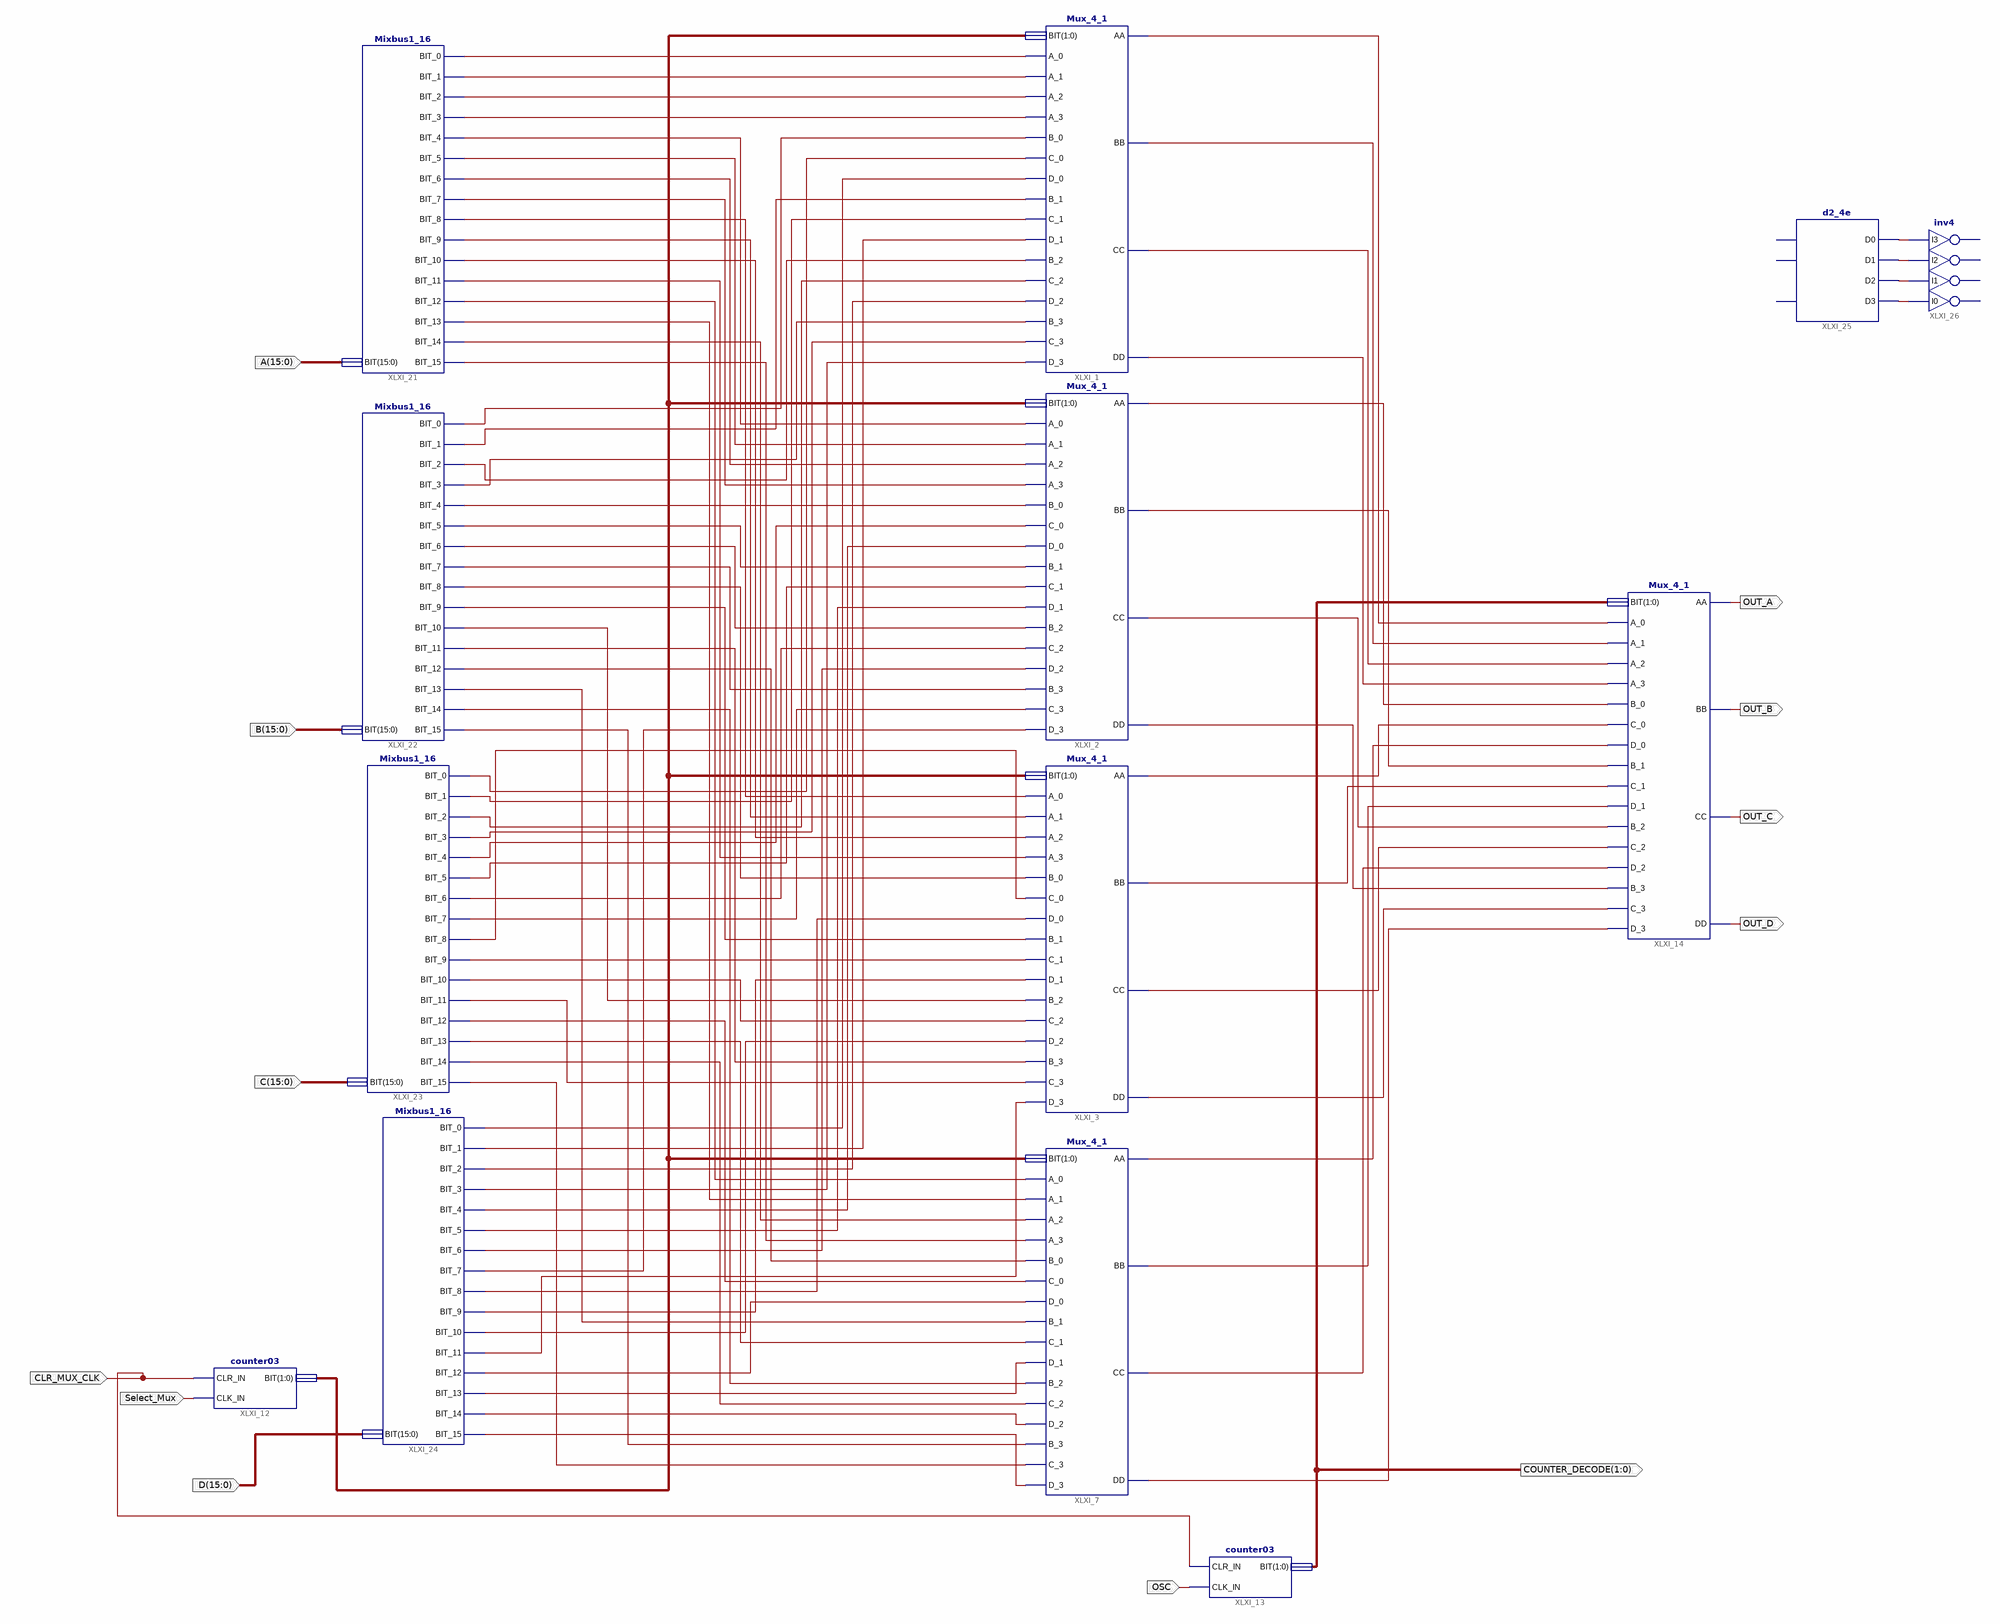
[diagram p0: schematic sheet 1]
// Xilinx ISE schematic Mux_Swap_LED_4.sch (spartan6) as structural Verilog: 13 symbols, 12 ports
module Mux_Swap_LED_4 (
  input  Select_Mux,
  input  CLR_MUX_CLK,
  input  OSC,
  input  [15:0] A,
  input  [15:0] D,
  input  [15:0] B,
  input  [15:0] C,
  output [1:0] COUNTER_DECODE,
  output OUT_A,
  output OUT_B,
  output OUT_C,
  output OUT_D
);

  wire XLXN_11, XLXN_12, XLXN_13, XLXN_14, XLXN_36, XLXN_38, XLXN_39, XLXN_63, XLXN_75, XLXN_84, XLXN_87,
       XLXN_90, XLXN_109, XLXN_110, XLXN_111, XLXN_113, XLXN_114, XLXN_115, XLXN_116, XLXN_117, XLXN_118,
       XLXN_119, XLXN_120, XLXN_121, XLXN_122, XLXN_126, XLXN_127, XLXN_128, XLXN_129, XLXN_130, XLXN_131,
       XLXN_132, XLXN_133, XLXN_134, XLXN_135, XLXN_136, XLXN_137, XLXN_138, XLXN_139, XLXN_140, XLXN_141,
       XLXN_142, XLXN_143, XLXN_144, XLXN_145, XLXN_146, XLXN_147, XLXN_148, XLXN_149, XLXN_150, XLXN_151,
       XLXN_152, XLXN_153, XLXN_154, XLXN_155, XLXN_157, XLXN_158, XLXN_159, XLXN_160, XLXN_161, XLXN_162,
       XLXN_163, XLXN_164, XLXN_165, XLXN_166, XLXN_167, XLXN_168, XLXN_169, XLXN_170, XLXN_171, XLXN_172,
       XLXN_173, XLXN_174, XLXN_175, XLXN_176, XLXN_177, XLXN_178, XLXN_179, XLXN_180, XLXN_181, XLXN_182,
       XLXN_183, XLXN_184, XLXN_185;
  wire [1:0] XLXN_1;

  Mux_4_1 XLXI_1 (
    .BIT(XLXN_1), .A_0(XLXN_36), .A_1(XLXN_109), .A_2(XLXN_38), .A_3(XLXN_39), .B_0(XLXN_126),
    .C_0(XLXN_141), .D_0(XLXN_169), .B_1(XLXN_127), .C_1(XLXN_142), .D_1(XLXN_168), .B_2(XLXN_128),
    .C_2(XLXN_143), .D_2(XLXN_167), .B_3(XLXN_129), .C_3(XLXN_144), .D_3(XLXN_166), .AA(XLXN_11),
    .BB(XLXN_12), .CC(XLXN_13), .DD(XLXN_14));
  Mux_4_1 XLXI_2 (
    .BIT(XLXN_1), .A_0(XLXN_110), .A_1(XLXN_111), .A_2(XLXN_113), .A_3(XLXN_114), .B_0(XLXN_63),
    .C_0(XLXN_145), .D_0(XLXN_165), .B_1(XLXN_130), .C_1(XLXN_146), .D_1(XLXN_164), .B_2(XLXN_131),
    .C_2(XLXN_147), .D_2(XLXN_163), .B_3(XLXN_132), .C_3(XLXN_148), .D_3(XLXN_162), .AA(XLXN_170),
    .BB(XLXN_171), .CC(XLXN_172), .DD(XLXN_173));
  Mux_4_1 XLXI_3 (
    .BIT(XLXN_1), .A_0(XLXN_115), .A_1(XLXN_116), .A_2(XLXN_117), .A_3(XLXN_118), .B_0(XLXN_133),
    .C_0(XLXN_149), .D_0(XLXN_161), .B_1(XLXN_134), .C_1(XLXN_75), .D_1(XLXN_160), .B_2(XLXN_135),
    .C_2(XLXN_150), .D_2(XLXN_159), .B_3(XLXN_136), .C_3(XLXN_151), .D_3(XLXN_158), .AA(XLXN_174),
    .BB(XLXN_175), .CC(XLXN_176), .DD(XLXN_177));
  Mux_4_1 XLXI_7 (
    .BIT(XLXN_1), .A_0(XLXN_119), .A_1(XLXN_120), .A_2(XLXN_121), .A_3(XLXN_122), .B_0(XLXN_137),
    .C_0(XLXN_152), .D_0(XLXN_157), .B_1(XLXN_138), .C_1(XLXN_153), .D_1(XLXN_90), .B_2(XLXN_139),
    .C_2(XLXN_154), .D_2(XLXN_87), .B_3(XLXN_140), .C_3(XLXN_155), .D_3(XLXN_84), .AA(XLXN_178),
    .BB(XLXN_179), .CC(XLXN_180), .DD(XLXN_181));
  counter03 XLXI_12 (.CLR_IN(CLR_MUX_CLK), .CLK_IN(Select_Mux), .BIT(XLXN_1));
  counter03 XLXI_13 (.CLR_IN(CLR_MUX_CLK), .CLK_IN(OSC), .BIT(COUNTER_DECODE));
  Mux_4_1 XLXI_14 (
    .BIT(COUNTER_DECODE), .A_0(XLXN_11), .A_1(XLXN_12), .A_2(XLXN_13), .A_3(XLXN_14), .B_0(XLXN_170),
    .C_0(XLXN_174), .D_0(XLXN_178), .B_1(XLXN_171), .C_1(XLXN_175), .D_1(XLXN_179), .B_2(XLXN_172),
    .C_2(XLXN_176), .D_2(XLXN_180), .B_3(XLXN_173), .C_3(XLXN_177), .D_3(XLXN_181), .AA(OUT_A), .BB(OUT_B),
    .CC(OUT_C), .DD(OUT_D));
  Mixbus1_16 XLXI_21 (
    .BIT(A), .BIT_15(XLXN_122), .BIT_14(XLXN_121), .BIT_13(XLXN_120), .BIT_12(XLXN_119), .BIT_11(XLXN_118),
    .BIT_10(XLXN_117), .BIT_9(XLXN_116), .BIT_8(XLXN_115), .BIT_7(XLXN_114), .BIT_6(XLXN_113),
    .BIT_5(XLXN_111), .BIT_4(XLXN_110), .BIT_3(XLXN_39), .BIT_2(XLXN_38), .BIT_1(XLXN_109), .BIT_0(XLXN_36));
  Mixbus1_16 XLXI_22 (
    .BIT(B), .BIT_15(XLXN_140), .BIT_14(XLXN_139), .BIT_13(XLXN_138), .BIT_12(XLXN_137), .BIT_11(XLXN_136),
    .BIT_10(XLXN_135), .BIT_9(XLXN_134), .BIT_8(XLXN_133), .BIT_7(XLXN_132), .BIT_6(XLXN_131),
    .BIT_5(XLXN_130), .BIT_4(XLXN_63), .BIT_3(XLXN_129), .BIT_2(XLXN_128), .BIT_1(XLXN_127), .BIT_0(XLXN_126));
  Mixbus1_16 XLXI_23 (
    .BIT(C), .BIT_15(XLXN_155), .BIT_14(XLXN_154), .BIT_13(XLXN_153), .BIT_12(XLXN_152), .BIT_11(XLXN_151),
    .BIT_10(XLXN_150), .BIT_9(XLXN_75), .BIT_8(XLXN_149), .BIT_7(XLXN_148), .BIT_6(XLXN_147),
    .BIT_5(XLXN_146), .BIT_4(XLXN_145), .BIT_3(XLXN_144), .BIT_2(XLXN_143), .BIT_1(XLXN_142), .BIT_0(XLXN_141));
  Mixbus1_16 XLXI_24 (
    .BIT(D), .BIT_15(XLXN_84), .BIT_14(XLXN_87), .BIT_13(XLXN_90), .BIT_12(XLXN_157), .BIT_11(XLXN_158),
    .BIT_10(XLXN_159), .BIT_9(XLXN_160), .BIT_8(XLXN_161), .BIT_7(XLXN_162), .BIT_6(XLXN_163),
    .BIT_5(XLXN_164), .BIT_4(XLXN_165), .BIT_3(XLXN_166), .BIT_2(XLXN_167), .BIT_1(XLXN_168), .BIT_0(XLXN_169));
  d2_4e XLXI_25 (.D0(XLXN_185), .D1(XLXN_184), .D2(XLXN_183), .D3(XLXN_182));  // open: A0, A1, E
  inv4 XLXI_26 (.I0(XLXN_182), .I1(XLXN_183), .I2(XLXN_184), .I3(XLXN_185));  // open: O0, O1, O2, O3
endmodule
